# Altium schematic sheet PDOC.SchDoc
size A4
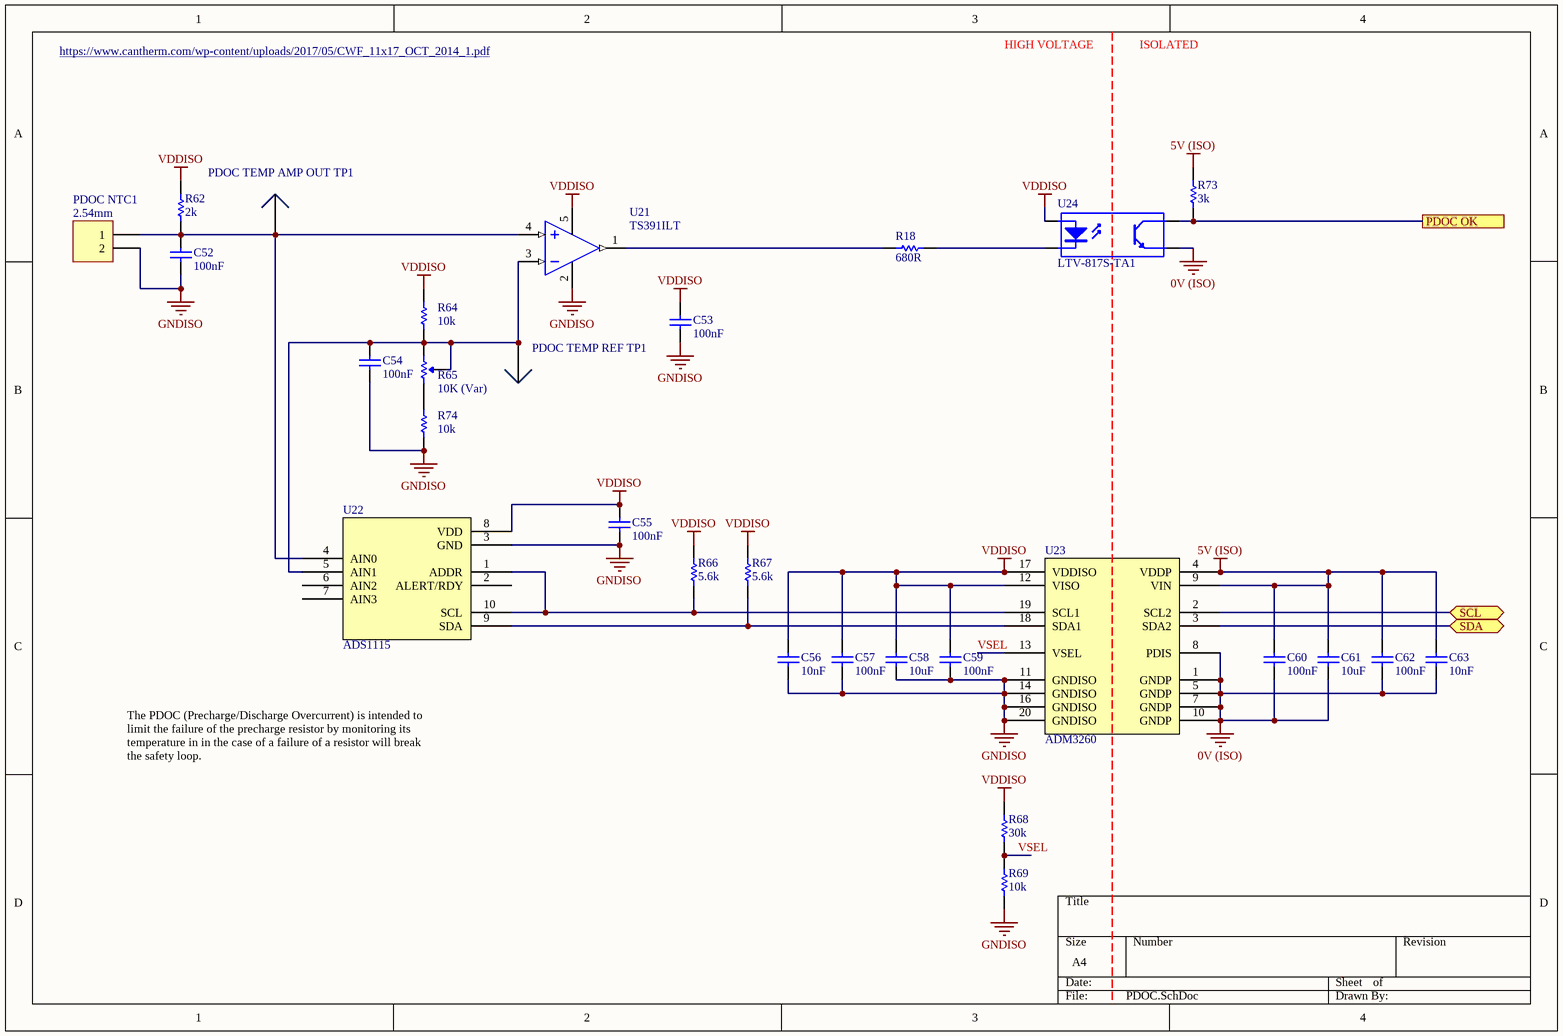
[diagram p0: PDOC.SchDoc]

## Parts
C52  100nF  [0805]
C53  100nF  [0805]
C54  100nF  [0805]
C55  100nF  [0805]
C56  10nF  [0805]
C57  100nF  [0805]
C58  10uF  [0805]
C59  100nF  [0805]
C60  100nF  [0805]
C61  10uF  [0805]
C62  100nF  [0805]
C63  10nF  [0805]
PDOC_NTC1  2.54mm  [TH 2.54mm Header 1x2]
PDOC_TEMP_AMP_OUT_TP1  0mm  [SMD Test Point]  (value not drawn)
PDOC_TEMP_REF_TP1  0mm  [SMD Test Point]  (value not drawn)
R18  680R  [0805]
R62  2k  [0805]
R64  10k  [0805]
R65  10K (Var)  [B 3296]
R66  5.6k  [0805]
R67  5.6k  [0805]
R68  30k  [0805]
R69  10k  [0805]
R73  3k  [0805]
R74  10k  [0805]
U21  TS391ILT  [ON SOT-23-5]
U22  ADS1115  [TI 10-VSSOP]
U23  ADM3260  [AD 20-SSOP]
U24  LTV-817S-TA1  [ON 4-SMD]

## Ports
PDOC OK, SCL (bidir), SDA (bidir)

## Nets
0V (ISO): C60.1 C61.1 C62.1 C63.1 U23.1(GNDP) U23.5(GNDP) U23.7(GNDP) U23.8(PDIS) U23.10(GNDP) U24.3(E)
5V (ISO): C60.2 C61.2 C62.2 C63.2 R73.2 U23.4(VDDP) U23.9(VIN)
GNDISO: C52.1 C53.1 C54.1 C55.2 C56.1 C57.1 C58.1 C59.2 PDOC_NTC1.2 R69.1 R74.1 U21.2(VCC-) U22.3(GND) U23.11(GNDISO) U23.14(GNDISO) U23.16(GNDISO) U23.20(GNDISO)
VDDISO: C53.2 C55.1 C56.2 C57.2 C58.2 C59.1 R62.2 R64.2 R66.2 R67.2 R68.2 U21.5(VCC+) U22.8(VDD) U23.12(VISO) U23.17(VDDISO) U24.1(A)
PDOC OK: R73.1 U24.4(C) ; port PDOC OK
SCL: U23.2(SCL2) ; port SCL
SDA: U23.3(SDA2) ; port SDA
VSEL: R68.1 R69.2 U23.13(VSEL)
NetC52_2: C52.2 PDOC_NTC1.1 PDOC_TEMP_AMP_OUT_TP1.1 R62.1 U21.4(IIN+) U22.4(AIN0)
NetC54_2: C54.2 PDOC_TEMP_REF_TP1.1 R64.1 R65.1(CCW) R65.2(Wiper) U21.3(IN-) U22.5(AIN1)
NetR18_1: R18.1 U21.1(OUT)
NetR18_2: R18.2 U24.2(K)
NetR65_3: R65.3(CW) R74.2
NetR66_1: R66.1 U22.1(ADDR) U22.10(SCL) U23.19(SCL1)
NetR67_1: R67.1 U22.9(SDA) U23.18(SDA1)

Not connected (* = marked no-connect by the designer): U22 2(ALERT/RDY) 6(AIN2) 7(AIN3)

## Notes on the sheet
- https://www.cantherm.com/wp-content/uploads/2017/05/CWF_11x17_OCT_2014_1.pdf
- HIGH VOLTAGE
- ISOLATED
- The PDOC (Precharge/Discharge Overcurrent) is intended to limit the failure of the precharge resistor by monitoring its temperature in in the case of a failure of a resistor will break the safety loop.

## Library data of the parts
C52-C55 C57 C59 C60 C62 = GCM21BR71H104KA37L: Manufacturer: muRata; Tolerance: ±10%; Material: X7R; Rated Voltage: 50V; Part Number: GCM21BR71H104KA37L; Value: 100nF; Digikey Part Number: 490-6064-1-ND
C56 C63 = GCM2195C1H103JA16D: Manufacturer: muRata; Tolerance: ±5%; Material: C0G, NP0; Rated Voltage: 50V; Part Number: GCM2195C1H103JA16D; Value: 10nF; Digikey Part Number: 490-4783-1-ND
C58 C61 = GRM21BR6YA106KE43L: Manufacturer: muRata; Tolerance: 10%; Material: X5R; Rated Voltage: 50V; Part Number: GRM21BR6YA106KE43L; Value: 10uF; Digikey Part Number: 490-10514-6-ND
PDOC_NTC1 = TH 2.54mm Header 1x2: Positions: 2; Angle: 0; Flange: No; Contact: NA; Part Number: TH 2.54mm Header 1x2; Pitch: 2.54mm; Row Spacing: 2.54mm
PDOC_TEMP_AMP_OUT_TP1 PDOC_TEMP_REF_TP1 = SMD Test Point: Positions: 1; Row Spacing: 0; Flange: No; Contact: NA; Part Number: SMD Test Point; Pitch: 0mm; Angle: 0
R18 = RC0805FR07680RL: Manufacturer: YAGEO; Tolerance: 0.01; Rated Voltage: 0.125W; Part Number: RC0805FR07680RL; Value: 680R; Material: FR-07; Digikey Part Number: 311-680CRCT-ND
R62 = RC0805FR072KL: Manufacturer: YAGEO; Tolerance: 0.01; Rated Voltage: 0.125W; Part Number: RC0805FR072KL; Value: 2k; Material: FR-07; Digikey Part Number: 311-2.00KCRCT-ND
R64 R69 R74 = RC0805FR0710KL: Manufacturer: YAGEO; Tolerance: 0.01; Rated Voltage: 0.125W; Part Number: RC0805FR0710KL; Value: 10k; Material: FR-07; Digikey Part Number: 311-10.0KCRCT-ND
R65 = 3296W-1-103LF: Manufacturer: Bournes Inc; Tolerance: 0.1; Rated Voltage: 0.5W; Part Number: 3296W-1-103LF; Value: 10K (Var); Digikey Part Number: 3296W-103LF-ND
R66 R67 = RC0805FR075K6L: Manufacturer: YAGEO; Tolerance: 0.01; Rated Voltage: 0.125W; Part Number: RC0805FR075K6L; Value: 5.6k; Material: FR-07; Digikey Part Number: 311-5.60KCRCT-ND
R68 = RC0805FR0730KL: Manufacturer: YAGEO; Tolerance: 0.01; Rated Voltage: 0.125W; Part Number: RC0805FR0730KL; Value: 30k; Material: FR-07; Digikey Part Number: 311-30.0KCRCT-ND
R73 = RC0805FR073KL: Manufacturer: YAGEO; Tolerance: 0.01; Rated Voltage: 0.125W; Part Number: RC0805FR073KL; Value: 3k; Material: FR-07; Digikey Part Number: 311-3.00KCRCT-ND
U21 = TS391ILT: IC COMP LO PWR SGL V SOT 23-5L; Manufacturer: STMicroelectronics; Part Number: TS391ILT; Digikey Part Number: 497-2275-2-ND; Digikey Link: https://www.digikey.com/product-detail/en/stmicroelectronics/TS391ILT/497-2275-2-ND/599407
U22 = ADS1115: 16 Bit Analog to Digital Converter 2, 4 Input 1 Sigma-Delta 10-VSSOP; Manufacturer: Texas Instruments; Part Number: ADS1115; Digikey Part Number: 296-38849-1-ND; Digikey Link: https://www.digikey.com/product-detail/en/texas-instruments/ADS1115IDGSR/296-38849-1-ND/5142969
U23 = ADM3260: I²C Digital Isolator 2500Vrms 2 Channel 25kV/µs CMTI 20-SSOP (0.209", 5.30mm Width); Manufacturer: Analog Devices; Part Number: ADM3260; Digikey Part Number: ADM3260ARSZ-RL7CT-ND; Digikey Link: https://www.digikey.com/product-detail/en/analog-devices-inc/ADM3260ARSZ-RL7/ADM3260ARSZ-RL7CT-ND/5233040
U24 = LTV-817S-TA1: 35V 50ma Optocoupler (VF=1.2V); Manufacturer: Lite-On Inc; Part Number: LTV-817S-TA1; Digikey Part Number: 160-1893-2-ND; Digikey Link: https://www.digikey.com/product-detail/en/lite-on-inc/LTV-817S-TA1/160-1893-2-ND/388451